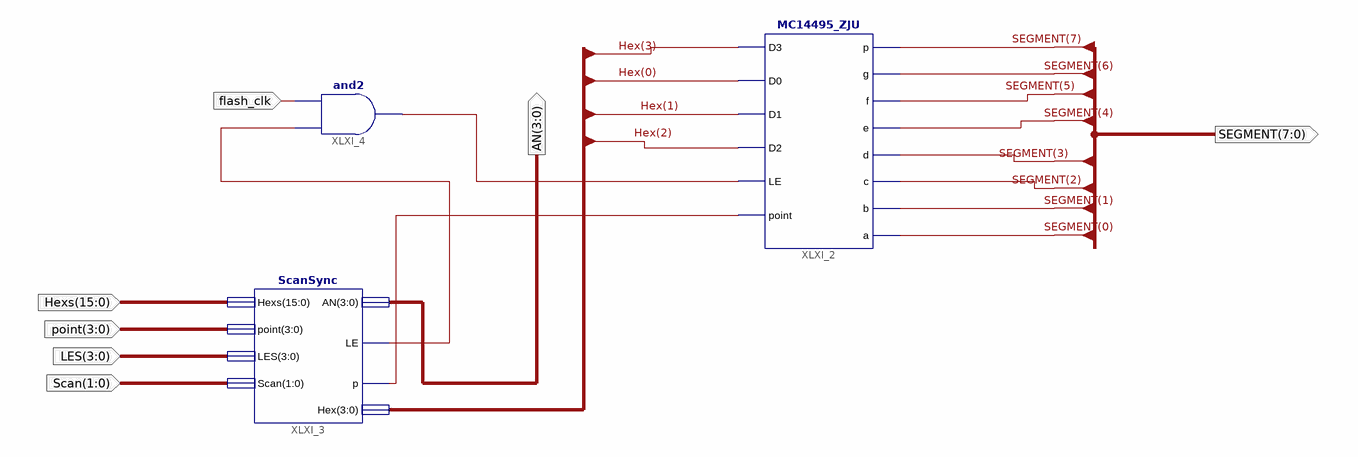
[diagram p0: schematic sheet 1]
// Xilinx ISE schematic Seg7_Dev16.sch (kintex7) as structural Verilog: 3 symbols, 7 ports
module Seg7_Dev16 (
  input  [15:0] Hexs,
  input  [3:0] point,
  input  [3:0] LES,
  input  [1:0] Scan,
  input  flash_clk,
  output [3:0] AN,
  output [7:0] SEGMENT
);

  wire XLXN_15, XLXN_25, XLXN_27;
  wire [3:0] Hex;

  MC14495_ZJU XLXI_2 (
    .D3(Hex[3]), .D0(Hex[0]), .D1(Hex[1]), .D2(Hex[2]), .LE(XLXN_27), .point(XLXN_15), .p(SEGMENT[7]),
    .g(SEGMENT[6]), .f(SEGMENT[5]), .e(SEGMENT[4]), .d(SEGMENT[3]), .c(SEGMENT[2]), .b(SEGMENT[1]),
    .a(SEGMENT[0]));
  ScanSync XLXI_3 (.Hexs(Hexs), .point(point), .LES(LES), .Scan(Scan), .AN(AN), .LE(XLXN_25), .p(XLXN_15), .Hex(Hex));
  and XLXI_4 (XLXN_27, XLXN_25, flash_clk);
endmodule
